# EAGLE design board (EAGLE 7.0.0)
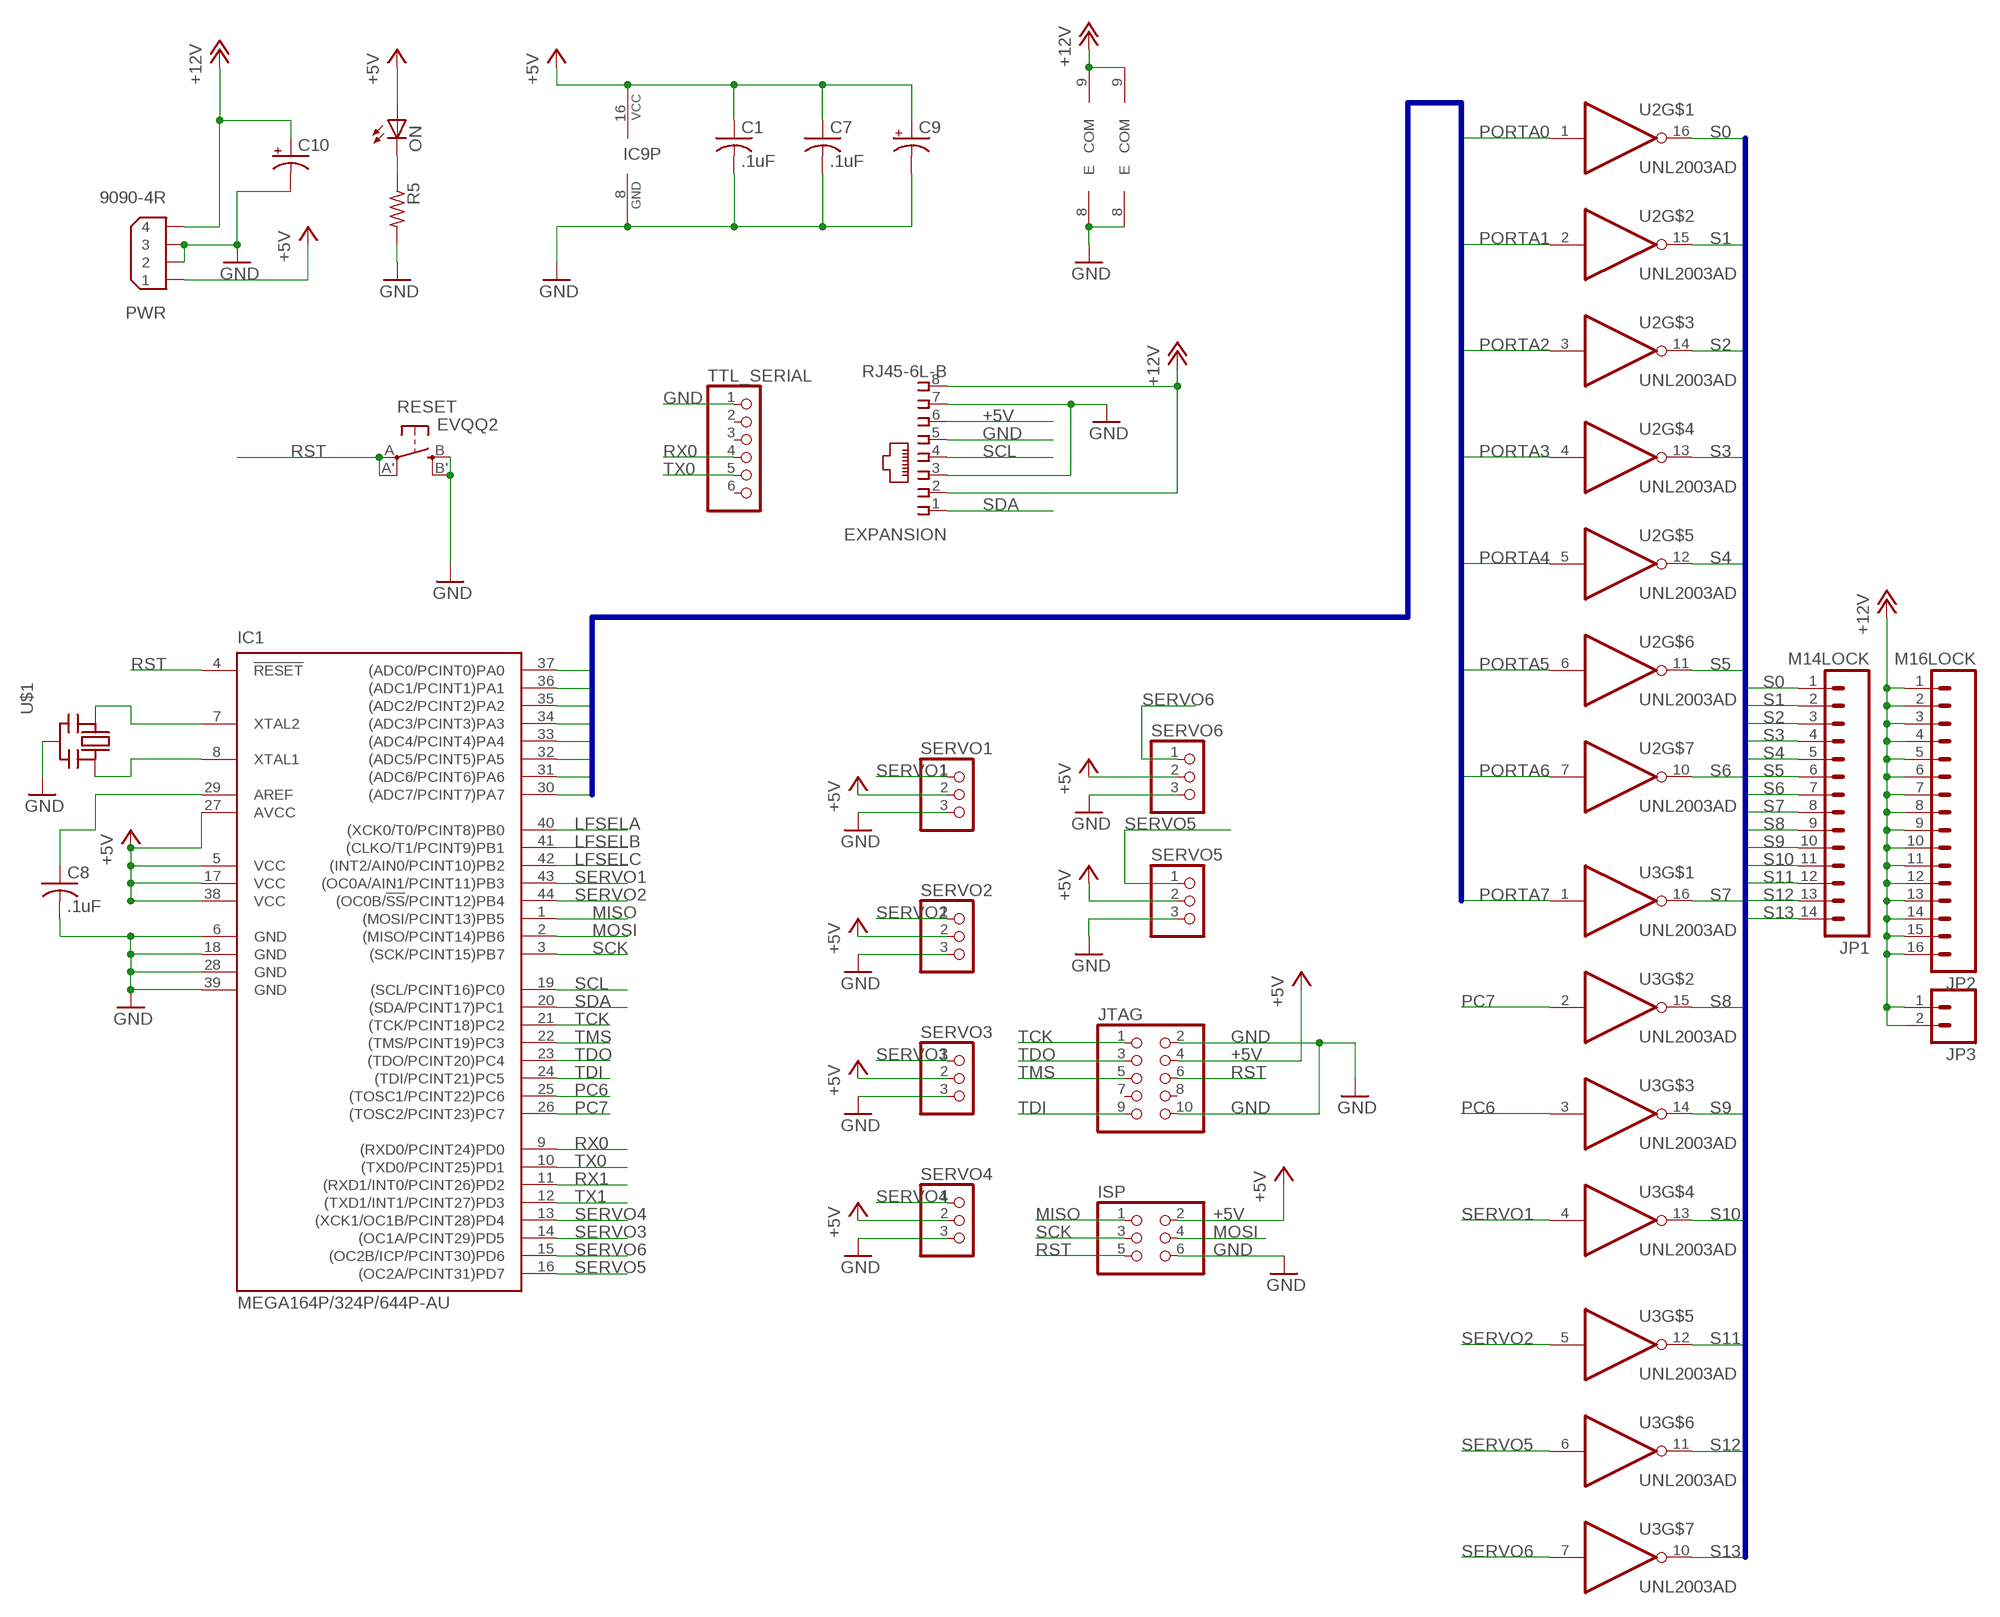
[diagram p0: schematic, sheet 1, part 1 of 2]
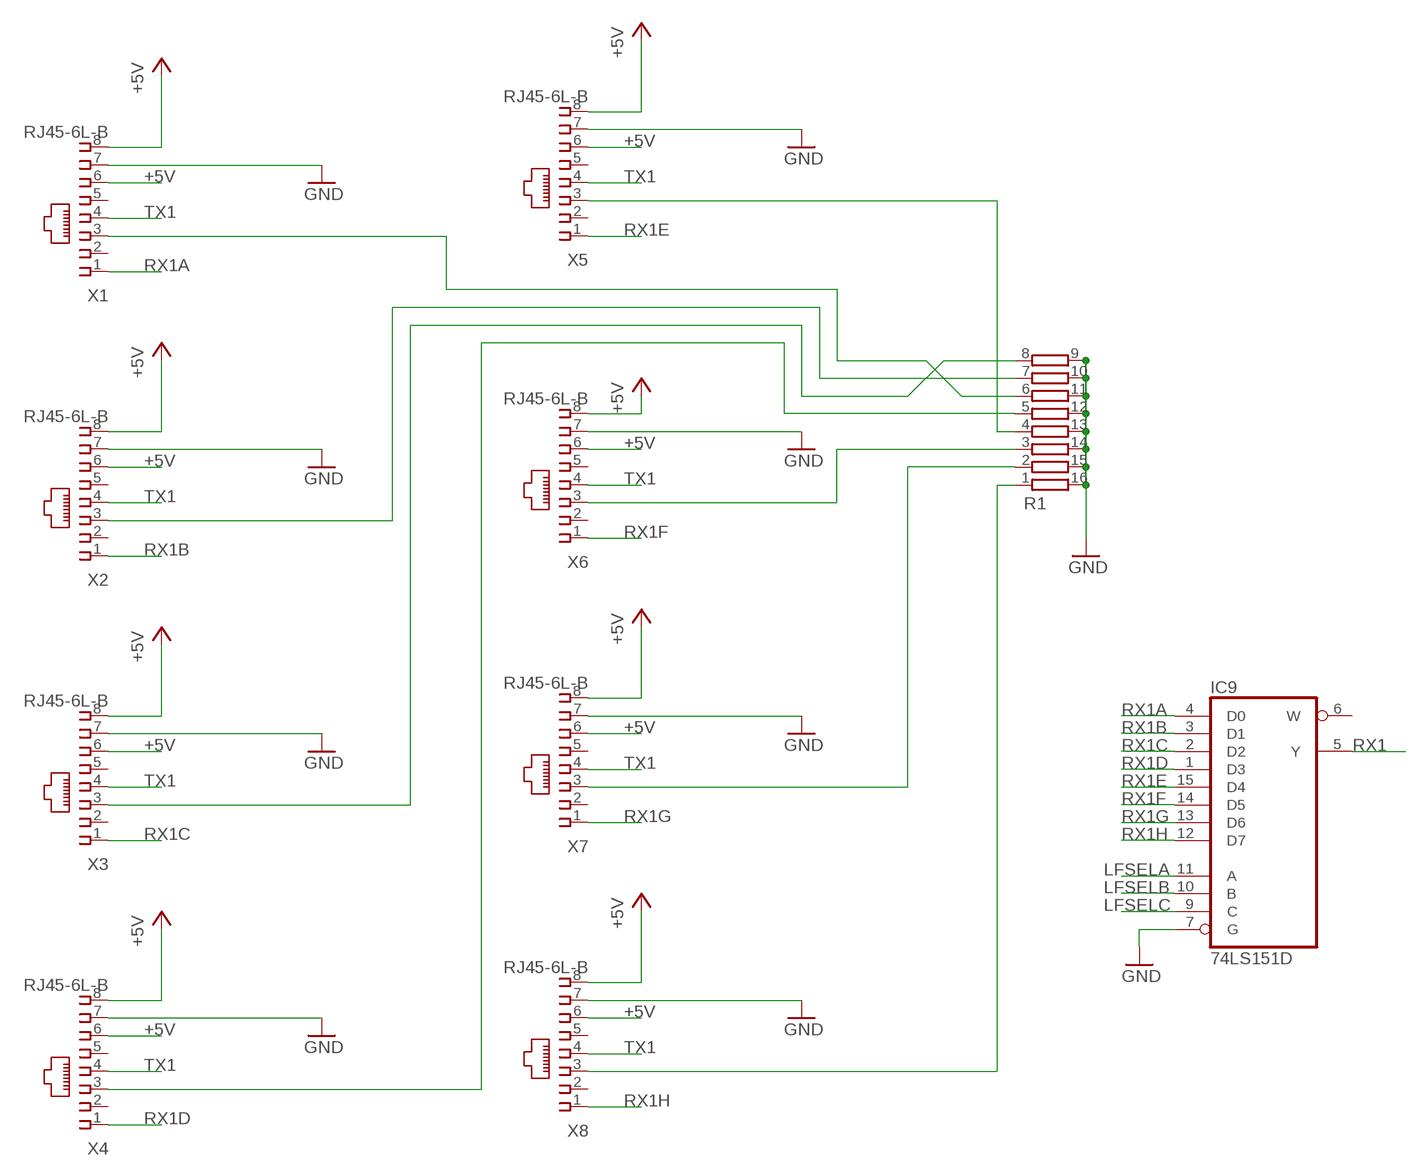
[diagram p1: schematic, sheet 1, part 2 of 2]

## Parts
C1  .1uF  C-USC0805  [C0805]
C7  .1uF  C-USC0805  [C0805]
C8  .1uF  C-USC0805  [C0805]
C9  CPOL-USE2.5-7  [E2,5-7]
C10  CPOL-USE2.5-7  [E2,5-7]
EXPANSION  RJ45-6L-B  [RJ45-NO-SHIELD]
IC1  MEGA164P/324P/644P-AU  [TQFP44]
IC9  74LS151D  [SO16]
ISP  PINHD-2X3  [2X03]
JP1  M14LOCK  [1X14_LOCK]
JP2  M16LOCK  [1X16_LOCK]
JP3  M02PTH  [1X02]
JTAG  PINHD-2X5  [2X05]
ON  LEDCHIPLED_0805  [CHIPLED_0805]
PWR  9090-4R  [9090-4R]
R1  2NBS16-8  [SO16]
R5  R-US_R0805  [R0805]
RESET  EVQQ2  [EVQ-Q2]
SERVO1  PINHD-1X3  [1X03]
SERVO2  PINHD-1X3  [1X03]
SERVO3  PINHD-1X3  [1X03]
SERVO4  PINHD-1X3  [1X03]
SERVO5  PINHD-1X3  [1X03]
SERVO6  PINHD-1X3  [1X03]
TTL_SERIAL  PINHD-1X6  [1X06]
U2  UNL2003AD  [SO16]
U3  UNL2003AD  [SO16]
U$1  CERMOSCILL-CSTCRG  [CSTCR-G]
X1  RJ45-6L-B  [RJ45-NO-SHIELD]
X2  RJ45-6L-B  [RJ45-NO-SHIELD]
X3  RJ45-6L-B  [RJ45-NO-SHIELD]
X4  RJ45-6L-B  [RJ45-NO-SHIELD]
X5  RJ45-6L-B  [RJ45-NO-SHIELD]
X6  RJ45-6L-B  [RJ45-NO-SHIELD]
X7  RJ45-6L-B  [RJ45-NO-SHIELD]
X8  RJ45-6L-B  [RJ45-NO-SHIELD]

## Nets
+5V [pwr12]: C1.1 C7.1 C9.+ EXPANSION.6 IC1.5(VCC) IC1.17(VCC) IC1.27(AVCC) IC1.38(VCC) IC9.16(VCC) ISP.2 JTAG.4 ON.A PWR.1 SERVO1.2 SERVO2.2 SERVO3.2 SERVO4.2 SERVO5.2 SERVO6.2 X1.6 X1.8 X2.6 X2.8 X3.6 X3.8 X4.6 X4.8 X5.6 X5.8 X6.6 X6.8 X7.6 X7.8 X8.6 X8.8
+12V [pwr12]: C10.+ EXPANSION.2 EXPANSION.8 JP2.1 JP2.2 JP2.3 JP2.4 JP2.5 JP2.6 JP2.7 JP2.8 JP2.9 JP2.10 JP2.11 JP2.12 JP2.13 JP2.14 JP2.15 JP2.16 JP3.1 JP3.2 PWR.4 U2.9(COM) U3.9(COM)
GND [pwr12]: C1.2 C7.2 C8.2 C9.- C10.- EXPANSION.3 EXPANSION.5 EXPANSION.7 IC1.6(GND) IC1.18(GND) IC1.28(GND) IC1.39(GND) IC9.7(G) IC9.8(GND) ISP.6 JTAG.2 JTAG.10 PWR.2 PWR.3 R1.9 R1.10 R1.11 R1.12 R1.13 R1.14 R1.15 R1.16 R5.2 RESET.B'(S1) RESET.B(S) SERVO1.3 SERVO2.3 SERVO3.3 SERVO4.3 SERVO5.3 SERVO6.3 TTL_SERIAL.1 U2.8(E) U3.8(E) U$1.2(GND) X1.7 X2.7 X3.7 X4.7 X5.7 X6.7 X7.7 X8.7
LFSELA: IC1.40((XCK0/T0/PCINT8)PB0) IC9.11(A)
LFSELB: IC1.41((CLKO/T1/PCINT9)PB1) IC9.10(B)
LFSELC: IC1.42((INT2/AIN0/PCINT10)PB2) IC9.9(C)
MISO: IC1.1((MOSI/PCINT13)PB5) ISP.1
MOSI: IC1.2((MISO/PCINT14)PB6) ISP.4
N$1: IC1.7(XTAL2) U$1.1(IN)
N$2: IC1.8(XTAL1) U$1.3(OUT)
N$3 [pwr12]: R1.1 X8.3
N$4 [pwr12]: R1.6 X1.3
N$5 [pwr12]: R1.7 X2.3
N$6 [pwr12]: R1.8 X3.3
N$7 [pwr12]: R1.5 X4.3
N$8 [pwr12]: R1.4 X5.3
N$9 [pwr12]: R1.3 X6.3
N$10 [pwr12]: R1.2 X7.3
N$17: C8.1 IC1.29(AREF)
N$31: ON.C R5.1
PC6: IC1.25((TOSC1/PCINT22)PC6) U3.3(I)
PC7: IC1.26((TOSC2/PCINT23)PC7) U3.2(I)
PORTA0: IC1.37((ADC0/PCINT0)PA0) U2.1(I)
PORTA1: IC1.36((ADC1/PCINT1)PA1) U2.2(I)
PORTA2: IC1.35((ADC2/PCINT2)PA2) U2.3(I)
PORTA3: IC1.34((ADC3/PCINT3)PA3) U2.4(I)
PORTA4: IC1.33((ADC4/PCINT4)PA4) U2.5(I)
PORTA5: IC1.32((ADC5/PCINT5)PA5) U2.6(I)
PORTA6: IC1.31((ADC6/PCINT6)PA6) U2.7(I)
PORTA7: IC1.30((ADC7/PCINT7)PA7) U3.1(I)
RST: IC1.4(!RESET) ISP.5 JTAG.6 RESET.A'(P1) RESET.A(P)
RX0: IC1.9((RXD0/PCINT24)PD0) TTL_SERIAL.4
RX1: IC1.11((RXD1/INT0/PCINT26)PD2) IC9.5(Y)
RX1A: IC9.4(D0) X1.1
RX1B: IC9.3(D1) X2.1
RX1C: IC9.2(D2) X3.1
RX1D: IC9.1(D3) X4.1
RX1E: IC9.15(D4) X5.1
RX1F: IC9.14(D5) X6.1
RX1G: IC9.13(D6) X7.1
RX1H: IC9.12(D7) X8.1
S0: JP1.1 U2.16(O)
S1: JP1.2 U2.15(O)
S2: JP1.3 U2.14(O)
S3: JP1.4 U2.13(O)
S4: JP1.5 U2.12(O)
S5: JP1.6 U2.11(O)
S6: JP1.7 U2.10(O)
S7: JP1.8 U3.16(O)
S8: JP1.9 U3.15(O)
S9: JP1.10 U3.14(O)
S10: JP1.11 U3.13(O)
S11: JP1.12 U3.12(O)
S12: JP1.13 U3.11(O)
S13: JP1.14 U3.10(O)
SCK: IC1.3((SCK/PCINT15)PB7) ISP.3
SCL: EXPANSION.4 IC1.19((SCL/PCINT16)PC0)
SDA: EXPANSION.1 IC1.20((SDA/PCINT17)PC1)
SERVO1: IC1.43((OC0A/AIN1/PCINT11)PB3) SERVO1.1 U3.4(I)
SERVO2: IC1.44((OC0B/!SS!/PCINT12)PB4) SERVO2.1 U3.5(I)
SERVO3: IC1.14((OC1A/PCINT29)PD5) SERVO3.1
SERVO4: IC1.13((XCK1/OC1B/PCINT28)PD4) SERVO4.1
SERVO5: IC1.16((OC2A/PCINT31)PD7) SERVO5.1 U3.6(I)
SERVO6: IC1.15((OC2B/ICP/PCINT30)PD6) SERVO6.1 U3.7(I)
TCK: IC1.21((TCK/PCINT18)PC2) JTAG.1
TDI: IC1.24((TDI/PCINT21)PC5) JTAG.9
TDO: IC1.23((TDO/PCINT20)PC4) JTAG.3
TMS: IC1.22((TMS/PCINT19)PC3) JTAG.5
TX0: IC1.10((TXD0/PCINT25)PD1) TTL_SERIAL.5
TX1: IC1.12((TXD1/INT1/PCINT27)PD3) X1.4 X2.4 X3.4 X4.4 X5.4 X6.4 X7.4 X8.4
Unconnected: IC9.6(W) JTAG.7 JTAG.8 TTL_SERIAL.2 TTL_SERIAL.3 TTL_SERIAL.6 X1.2 X1.5 X2.2 X2.5 X3.2 X3.5 X4.2 X4.5 X5.2 X5.5 X6.2 X6.5 X7.2 X7.5 X8.2 X8.5

## Buses
PORTA[0..7]
S[0..13]

## Library data of the parts
C1 C7 C8 = rcl:C-US: CAPACITOR, American symbol
C9 C10 = rcl:CPOL-US: POLARIZED CAPACITOR, American symbol
EXPANSION X1-X8 = con-tycoelectronics:RJ45: CORCOM Modular RJ Jacks No Shield Source: www.tycoelectronics.com .. ENG_DS_1654001_1099_RJ_L_0507.pdf; MPN: RJ45-6L-B; OC_FARNELL: unknown; OC_NEWARK: 16R6090
IC1 = avr-5:MEGA164P/324P/644P-AU
IC9 = 74xx-us:74*151: Data SELECTOR/MULTIPLEXER
ISP = pinhead:PINHD-2X3: PIN HEADER
JP1 = SparkFun-Connectors:M14: Header 14 Standard 14-pin 0.1" header. Use with straight break away headers (SKU : PRT-00116), right angle break away headers (PRT-00553), swiss pins (PRT-00743), machine pins (PRT-00117), and female headers (PRT-00115).
JP2 = SparkFun-Connectors:M16: 1x16 .1" header
JP3 = SparkFun-Connectors:M02: Header 2 Standard 2-pin 0.1" header. Use with straight break away headers (SKU : PRT-00116), right angle break away headers (PRT-00553), swiss pins (PRT-00743), machine pins (PRT-00117), and female headers (PRT-00115). Molex polarized connector foot print use with SKU : PRT-08233 with associated crimp pins and housings.
JTAG = pinhead:PINHD-2X5: PIN HEADER
ON = led:LED: LED OSRAM: - CHIPLED LG R971, LG N971, LY N971, LG Q971, LY Q971, LO R971, LY R971 LH N974, LH R974 LS Q976, LO Q976, LY Q976 LO Q996 - Hyper CHIPLED LW Q18S LB Q993, LB Q99A, LB R99A - SideLED LS A670, LO A670, LY A670, LG A670, LP A670 LB A673, LV A673, LT A673, LW A673 LH A674 LY A675 LS A676, LA A676, LO A676, LY A676, LW A676 LS A679, LY A679, LG A679 - Hyper Micro SIDELED® LS Y876, LA Y876, LO Y876, LY Y876 LT Y87S - SmartLED LW L88C, LW L88S LB L89C, LB L89S, LG L890 LS L89K, LO L89K, LY L89K LS L896, LA L896, LO L896, LY L896 - TOPLED LS T670, LO T670, LY T670, LG T670, LP T670 LSG T670, LSP T670, LSY T670, LOP T670, LYG T670 LG T671, LOG T671, LSG T671 LB T673, LV T673, LT T673, LW T673 LH T674 LS T676, LA T676, LO T676, LY T676, LB T676, LH T676, LSB T676, LW T676 LB T67C, LV T67C, LT T67C, LS T67K, LO T67K, LY T67K, LW E67C LS E67B, LA E67B, LO E67B, LY E67B, LB E67C, LV E67C, LT E67C LW T67C LS T679, LY T679, LG T679 LS T770, LO T770, LY T770, LG T770, LP T770 LB T773, LV T773, LT T773, LW T773 LH T774 LS E675, LA E675, LY E675, LS T675 LS T776, LA T776, LO T776, LY T776, LB T776 LHGB T686 LT T68C, LB T68C - Hyper Mini TOPLED® LB M676 - Mini TOPLED Santana® LG M470 LS M47K, LO M47K, LY M47K Source: http://www.osram.convergy.de LUXEON: - LUMILED® LXK2-PW12-R00, LXK2-PW12-S00, LXK2-PW14-U00, LXK2-PW14-V00 LXK2-PM12-R00, LXK2-PM12-S00, LXK2-PM14-U00 LXK2-PE12-Q00, LXK2-PE12-R00, LXK2-PE12-S00, LXK2-PE14-T00, LXK2-PE14-U00 LXK2-PB12-K00, LXK2-PB12-L00, LXK2-PB12-M00, LXK2-PB14-N00, LXK2-PB14-P00, LXK2-PB14-Q00 LXK2-PR12-L00, LXK2-PR12-M00, LXK2-PR14-Q00, LXK2-PR14-R00 LXK2-PD12-Q00, LXK2-PD12-R00, LXK2-PD12-S00 LXK2-PH12-R00, LXK2-PH12-S00 LXK2-PL12-P00, LXK2-PL12-Q00, LXK2-PL12-R00 Source: www.luxeon.com KINGBRIGHT: KA-3528ASYC Source: www.kingbright.com
PWR = con-thomas-betts:9090-4: Disk Drive Power four position Source: Thomas & Betts Electronic Interconnects Eiropean Edition 1998; OC_FARNELL: unknown; OC_NEWARK: unknown
R1 = resistor-bourns:2NBS16-8: BOURNS RESISTOR NETWORK; OC_FARNELL: unknown; OC_NEWARK: unknown
R5 = rcl:R-US_: RESISTOR, American symbol
RESET = adafruit:EVQQ2: SMT 6mm switch, EVQQ2 series http://www.ladyada.net/library/eagle
SERVO1-SERVO6 = pinhead:PINHD-1X3: PIN HEADER
TTL_SERIAL = pinhead:PINHD-1X6: PIN HEADER
U2 U3 = Chris_parts:UNL2003A
U$1 = adafruit:CERMOSCILL: Ceramic oscillator with built in capacitors such as ZTT-12MHz http://www.ladyada.net/library/eagle

## Net classes
0 default: width 0.254 mm, drill 0.3 mm, clearance 0.254 mm
1 pwr12: width 0.508 mm, drill 0.4 mm, clearance 0.254 mm

## Board
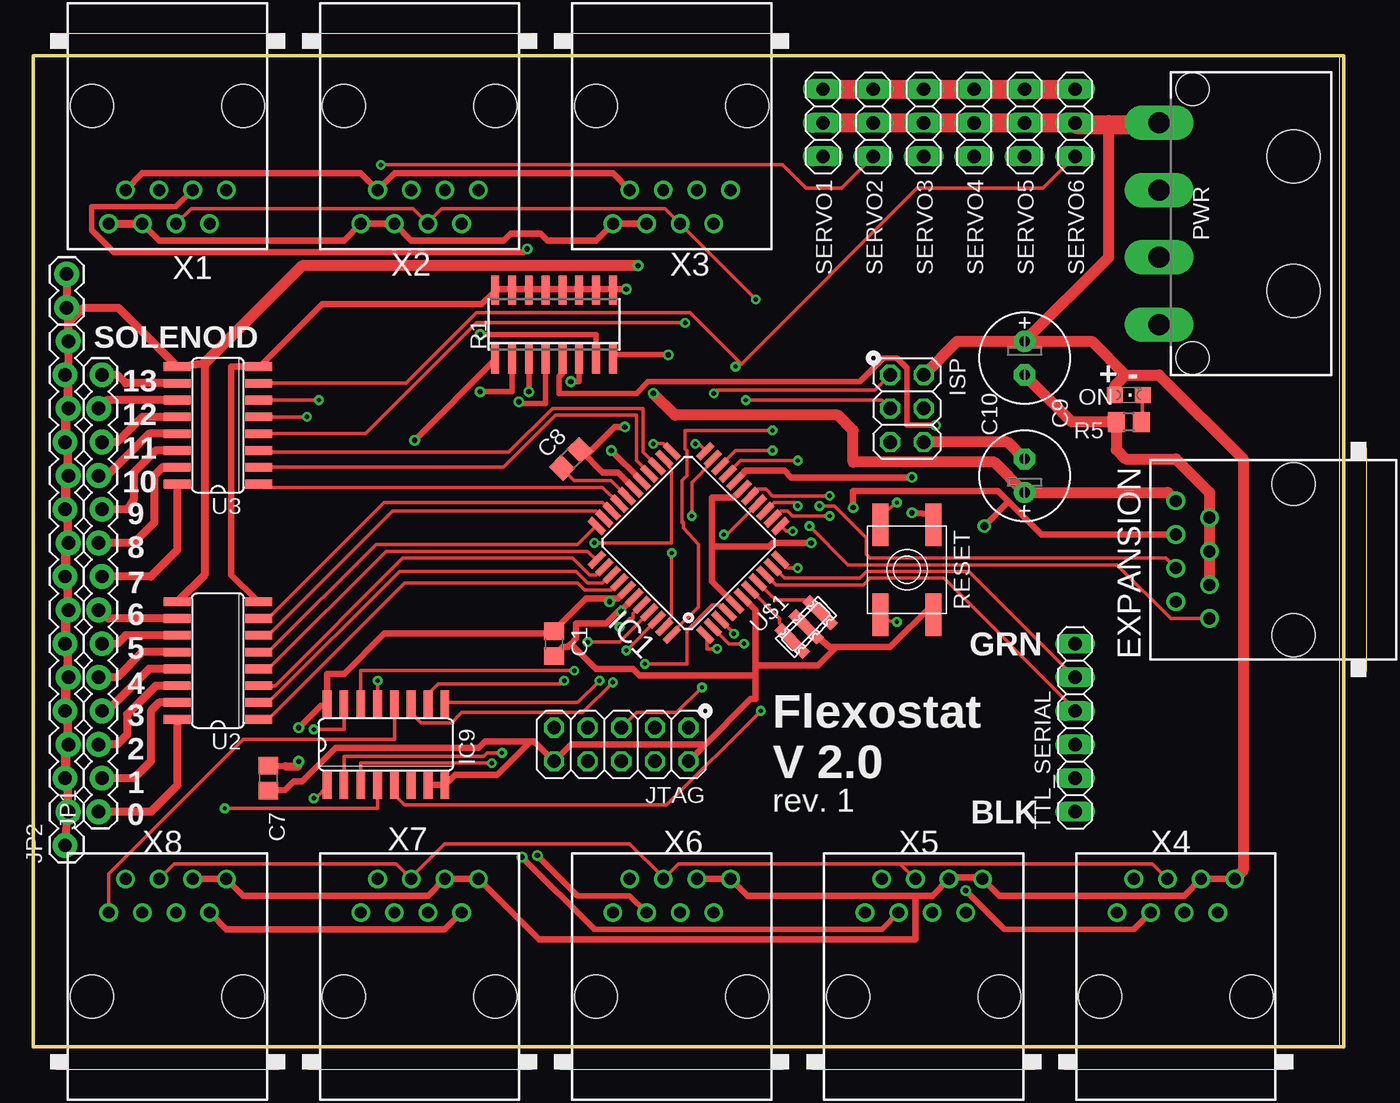
[diagram p2: board, top side]
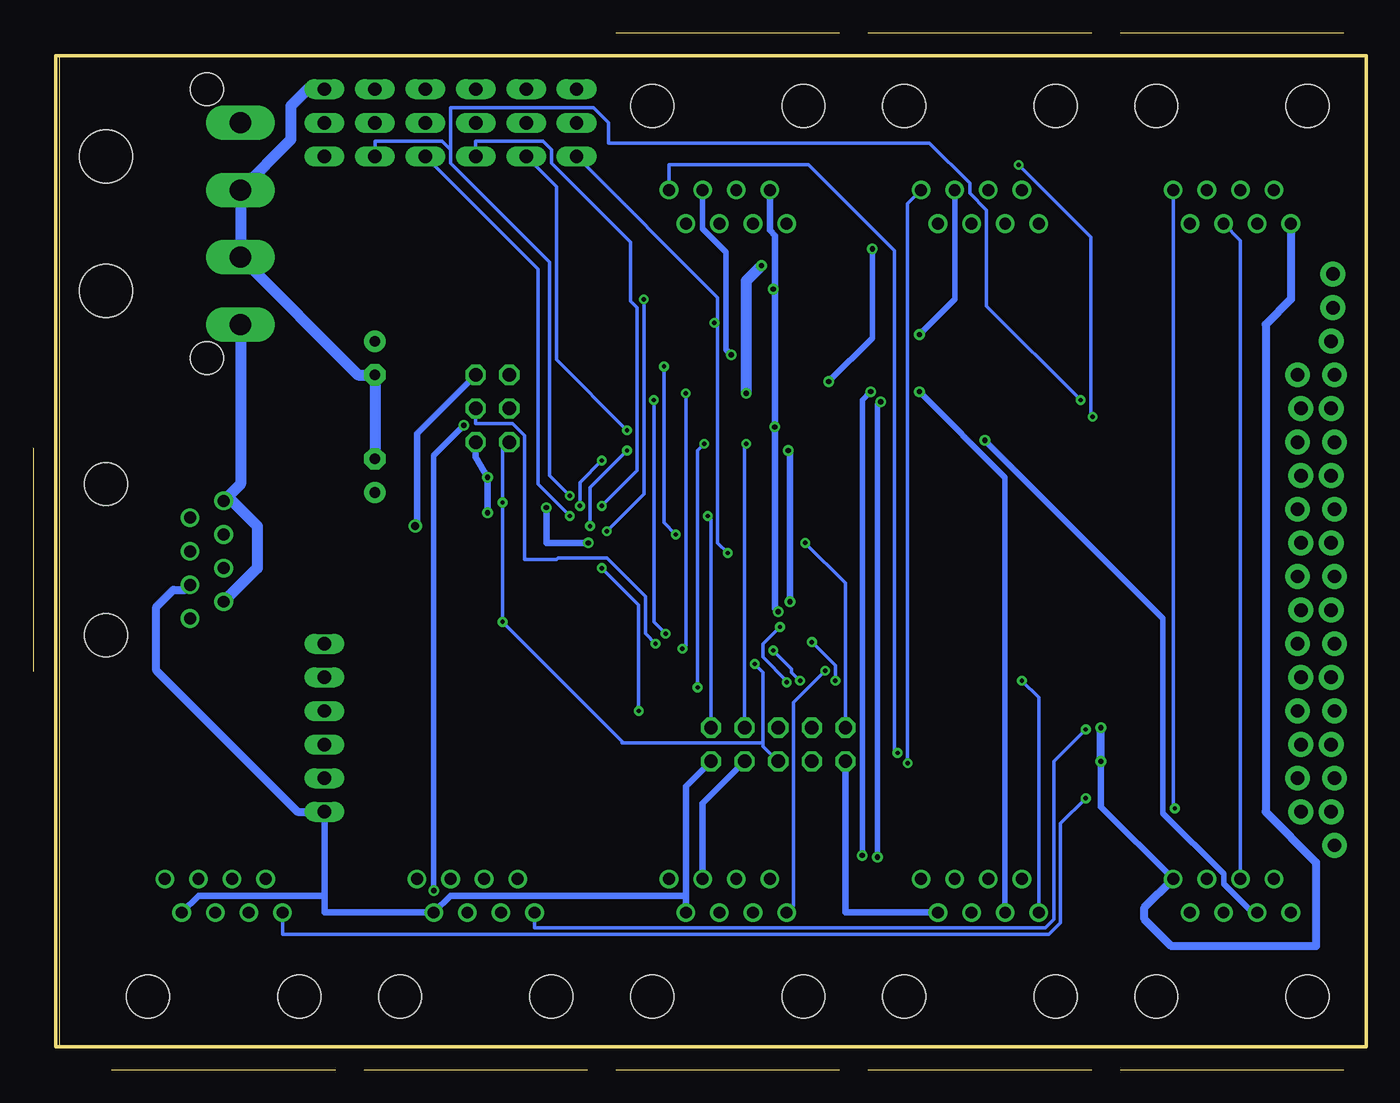
[diagram p3: board, bottom side, seen from below]

Size 98.73 x 74.92 mm. Coordinates in mm from the lower left corner, seen from the top.
Outline: 0,0 98.73,0 98.73,74.92 0,74.92 0,0
Copper layers (1*16): Top 0.035mm / dielectric 1.5mm / Bottom 0.035mm
Design rules "default *": minimum track width 10mil, minimum drill 13mil, track to track 8mil, track to pad 8mil, pad to pad 8mil, via to via 8mil, smd to smd 1mil, copper to edge 40mil, drill to drill 8mil, minimum pad ring 10mil, minimum via ring 8mil, stop-mask expansion 4mil, vias tented up to drill 0.61mm, thermal gap 10mil
vRestrict: area 42.9,36.1 to 51.3,44.5; area 43.2,31.8 to 50.3,39.9; area 47.5,31.8 to 55.9,40.1; area 49,36.1 to 55.9,44.5; area 21.6,20.8 to 31.8,24.6; area 34.3,53.6 to 44.5,56.1
Milling: 4 lines

### Footprints (pad centres in the part's own frame; a part is rotated, then mirrored left to right if it is on the bottom)
C0805 = smd 1.3 x 1.5: 1 -0.95,0; 2 0.95,0
E2,5-7 = drill 0.813 pad 1.6: + -1.27,0 | drill 0.813 pad 1.6 octagon: - 1.27,0
RJ45-NO-SHIELD = drill 0.9 pad 1.4: 1 -4.445,6.35; 2 -3.175,8.89; 3 -1.905,6.35; 4 -0.635,8.89; 5 0.635,6.35; 6 1.905,8.89; 7 3.175,6.35; 8 4.445,8.89 | hole 3.251: -5.715,0; 5.715,0
TQFP44 = smd 1.5 x 0.5: 1 -5.8,4; 2 -5.8,3.2; 3 -5.8,2.4; 4 -5.8,1.6; 5 -5.8,0.8; 6 -5.8,0; 7 -5.8,-0.8; 8 -5.8,-1.6; 9 -5.8,-2.4; 10 -5.8,-3.2; 11 -5.8,-4; 23 5.8,-4; 24 5.8,-3.2; 25 5.8,-2.4; 26 5.8,-1.6; 27 5.8,-0.8; 28 5.8,0; 29 5.8,0.8; 30 5.8,1.6; 31 5.8,2.4; 32 5.8,3.2; 33 5.8,4 | smd 0.5 x 1.5: 12 -4,-5.8; 13 -3.2,-5.8; 14 -2.4,-5.8; 15 -1.6,-5.8; 16 -0.8,-5.8; 17 0,-5.8; 18 0.8,-5.8; 19 1.6,-5.8; 20 2.4,-5.8; 21 3.2,-5.8; 22 4,-5.8; 34 4,5.8; 35 3.2,5.8; 36 2.4,5.8; 37 1.6,5.8; 38 0.8,5.8; 39 0,5.8; 40 -0.8,5.8; 41 -1.6,5.8; 42 -2.4,5.8; 43 -3.2,5.8; 44 -4,5.8
SO16 = smd 0.66 x 2.032: 1 -4.445,-3.073; 2 -3.175,-3.073; 3 -1.905,-3.073; 4 -0.635,-3.073; 5 0.635,-3.073; 6 1.905,-3.073; 7 3.175,-3.073; 8 4.445,-3.073; 9 4.445,3.073; 10 3.175,3.073; 11 1.905,3.073; 12 0.635,3.073; 13 -0.635,3.073; 14 -1.905,3.073; 15 -3.175,3.073; 16 -4.445,3.073
2X03 = drill 1.016 octagon: 1 -2.54,-1.27; 2 -2.54,1.27; 3 0,-1.27; 4 0,1.27; 5 2.54,-1.27; 6 2.54,1.27
1X14_LOCK = drill 1.016 pad 1.88: 1 0,0.127; 2 2.54,-0.127; 3 5.08,0.127; 4 7.62,-0.127; 5 10.16,0.127; 6 12.7,-0.127; 7 15.24,0.127; 8 17.78,-0.127; 9 20.32,0.127; 10 22.86,-0.127; 11 25.4,0.127; 12 27.94,-0.127; 13 30.48,0.127; 14 33.02,-0.127
1X16_LOCK = drill 1.016 pad 1.88: 1 0,0.127; 2 2.54,-0.127; 3 5.08,0.127; 4 7.62,-0.127; 5 10.16,0.127; 6 12.7,-0.127; 7 15.24,0.127; 8 17.78,-0.127; 9 20.32,0.127; 10 22.86,-0.127; 11 25.4,0.127; 12 27.94,-0.127; 13 30.48,0.127; 14 33.02,-0.127; 15 35.56,0.127; 16 38.1,-0.127
1X02 = drill 1.016 pad 1.88: 1 0,0; 2 2.54,0
2X05 = drill 1.016 octagon: 1 -5.08,-1.27; 2 -5.08,1.27; 3 -2.54,-1.27; 4 -2.54,1.27; 5 0,-1.27; 6 0,1.27; 7 2.54,-1.27; 8 2.54,1.27; 9 5.08,-1.27; 10 5.08,1.27
CHIPLED_0805 = smd 1.2 x 1.2: A 0,-1.05; C 0,1.05
9090-4R = drill 1.6 pad 2.6 long: 1 -7.62,-6.35; 2 -2.54,-6.35; 3 2.54,-6.35; 4 7.62,-6.35 | hole 4: -5.08,3.81; 5.08,3.81 | hole 2.5: -10.16,-3.81; 10.16,-3.81
SO16' = smd 0.6 x 2.2: 1 -4.445,-2.6; 2 -3.175,-2.6; 3 -1.905,-2.6; 4 -0.635,-2.6; 5 0.635,-2.6; 6 1.905,-2.6; 7 3.175,-2.6; 8 4.445,-2.6; 9 4.445,2.6; 10 3.175,2.6; 11 1.905,2.6; 12 0.635,2.6; 13 -0.635,2.6; 14 -1.905,2.6; 15 -3.175,2.6; 16 -4.445,2.6
R0805 = smd 1.3 x 1.5: 1 -0.95,0; 2 0.95,0
EVQ-Q2 = smd 3.2 x 1.2: A -3.4,-2; A' 3.4,-2; B -3.4,2; B' 3.4,2
1X03 = drill 1.016 long: 1 -2.54,0; 2 0,0; 3 2.54,0
1X06 = drill 1.016 long: 1 -6.35,0; 2 -3.81,0; 3 -1.27,0; 4 1.27,0; 5 3.81,0; 6 6.35,0
CSTCR-G = smd 0.8 x 3: 1 -1.5,0; 2 0,0; 3 1.5,0

### Placement (x,y rotation side)
C1  39.37,30.48 270 top
C7  17.78,20.32 270 top
C8  40.64,44.45 45 top
C9  74.93,52.07 270 top
C10  74.93,43.18 90 top
EXPANSION  95.25,36.83 90 top
IC1  49.53,38.1 135 top
IC9  26.67,22.86 0 top
ISP  66.04,48.26 270 top
JP1  5.08,17.78 90 top
JP2  2.54,15.24 90 top
JP3  2.54,55.88 90 top
JTAG  44.45,22.86 180 top
ON  82.8,49.28 270 top
PWR  91.44,62.23 270 top
R1  [SO16']  39.37,54.61 0 top
R5  82.8,47.24 180 top
RESET  66.04,36.07 270 top
SERVO1  59.69,69.85 90 top
SERVO2  63.5,69.85 90 top
SERVO3  67.31,69.85 90 top
SERVO4  71.12,69.85 90 top
SERVO5  74.93,69.85 90 top
SERVO6  78.74,69.85 90 top
TTL_SERIAL  78.74,24.13 90 top
U2  13.97,29.21 90 top
U3  13.97,46.99 90 top
U$1  58.42,31.75 45 top
X1  10.16,71.12 180 top
X2  29.21,71.12 180 top
X3  48.26,71.12 180 top
X4  86.36,3.81 0 top
X5  67.31,3.81 0 top
X6  48.26,3.81 0 top
X7  29.21,3.81 0 top
X8  10.16,3.81 0 top

### Tracks (layer width: path | path; a pad name or v marks a point on that pad's centre or on a via)
+5V  (via drill 0.4, 0.6 pad 0.3)
  Top 0.508: 81.66,49.28 ON.A | 74.8,53.21 C9.+ | 51.31,37.85 51.31,41.53 52.96,41.53 IC1.17 | 51.31,37.85 51.31,35.18 52.96,33.53 IC1.5 | 51.31,37.85 55.63,37.85 55.88,38.1 v58.8,38.1 | v61.98,40.77 61.98,42.04 72.9,42.04 73.72,41.21 | 73.72,41.21 76.2,38.73 EXPANSION.6 | X4.8 X4.6 87,11.43 73.03,11.43 X5.8 71.63,12.83 69.34,12.83 X5.6 67.94,11.43 66.67,11.43 | X6.6 X6.8 53.98,11.43 66.67,11.43 | 19.05,21.21 C7.1 | X8.6 X8.8 15.88,11.43 29.84,11.43 X7.6 X7.8 38.23,8.13 66.67,8.13 66.67,11.43 | 43.56,33.91 44.2,33.91 44.83,34.54 IC1.38 | 43.56,33.91 41.78,33.91 39.37,31.5 C1.1 39.24,31.24 26.54,31.24 23.5,28.19 22.23,28.19 IC9.16 22.1,25.78 21.72,25.78 v20.07,24.13 | v43.69,45.09 45.97,42.8 IC1.27 | X3.6 X3.8 42.55,60.96 38.86,60.96 38.35,61.47 36.07,61.47 35.56,60.96 28.57,60.96 X2.6 X2.8 23.5,60.96 9.53,60.96 X1.6 | v43.56,33.66 43.56,33.91 | v71.88,39.37 73.72,41.21 | SERVO6.2 78.87,69.72
  Top 0.61: 19.05,21.21 20.07,21.21 v20.07,21.59 | X1.8 X1.6
  Top 0.813: 72.39,69.85 SERVO4.2 | 84.96,69.72 PWR.1 | C9.+ 81.28,59.69 81.28,69.72 | ON.A 81.75,50 82.55,50.8 | 82.55,50.8 85.09,50.8 91.44,44.45 91.44,13.34 X4.8 | C9.+ 80.01,53.34 82.55,50.8 | ISP.2 69.85,53.34 C9.+
  Top 1.422: SERVO1.2 SERVO2.2 SERVO3.2 SERVO4.2 SERVO5.2 SERVO6.2 | 78.87,69.72 81.28,69.72 84.96,69.72
  Bottom 0.508: v58.8,38.1 61.98,38.1 v61.98,40.77 | JTAG.4 50.16,18.41 X6.6 | X3.8 43.69,62.1 | v43.56,33.66 43.56,44.96 v43.69,45.09 | X8.8 20.07,18.16 v20.07,21.59 | ISP.2 71.75,46.35 71.75,39.5 v71.88,39.37
  Bottom 0.61: v20.07,21.59 v20.07,24.13 | X1.8 5.71,56.52 7.62,54.61 7.62,17.78 3.81,13.97 3.81,7.62 14.73,7.62 16.76,9.65 16.76,10.54 X8.8
+12V  (via drill 0.4)
  Top 0.406: 2.79,20.32 JP2.1 | 10.92,33.66 U2.9 | JP2.16 2.54,53.34 JP3.1 | JP2.15 2.67,50.8 2.67,52.07
  Top 0.508: 11.05,33.78 U2.9
  Top 0.61: JP2.1 2.67,20.57 JP2.2 2.41,23.11 JP2.3 2.67,25.65 JP2.4 2.41,28.19 JP2.5 2.67,30.73 JP2.6 2.41,33.27 JP2.7 2.67,35.81 JP2.8 2.41,38.35 JP2.9 2.67,40.89 JP2.10 2.41,43.43 JP2.11 2.67,45.97 JP2.12 2.41,48.51 JP2.13 2.67,51.05 JP2.14 2.67,52.07 JP2.16 | JP2.16 2.67,54.74 3.81,55.88 6.45,55.88 U3.9 12.95,51.69 12.95,35.69 11.05,33.78 | JP3.2 JP3.1 2.67,55.88 JP2.16
  Top 0.813: 12.95,51.69 20.32,59.05 v45.72,59.05 | v46.86,49.4 48.51,47.75 60.83,47.75 61.98,46.61 61.98,44.2 72.64,44.2 C10.+ 85.72,41.91 EXPANSION.8
  Bottom 0.406: 86.23,41.4 EXPANSION.8
  Bottom 0.813: v45.72,59.05 46.86,57.91 v46.86,49.4 | PWR.4 85.09,42.55 EXPANSION.8 85.72,41.27 83.82,39.37 83.82,36.2 EXPANSION.2
GND  (via drill 0.4)
  Top 0.406: 53.59,43.31 53.09,42.8
  Top 0.508: 53.09,42.8 IC1.18 | v66.42,40.39 67.94,40.26 RESET.B | 81.79,47.24 R5.2 | 88.77,40.13 EXPANSION.7 | 17.02,33.66 U2.8 16.89,33.78 14.99,35.69 14.99,51.44 U3.8 17.27,51.56 21.84,56.13 33.91,56.13 34.8,57.02 R1.16 34.92,57.28 36.2,57.28 R1.15 36.32,57.28 37.47,57.28 R1.14 37.59,57.28 38.73,57.28 R1.13 38.86,57.28 40.01,57.28 R1.12 40.13,57.28 41.27,57.28 R1.11 41.4,57.28 42.55,57.28 R1.10 42.67,57.28 43.81,57.28 R1.9 43.94,57.28 v44.83,57.28 | IC1.28 45.34,42.29 44.2,43.43 43.05,43.43 41.4,45.09 C8.2 41.91,44.83 43.94,46.86 v44.7,46.86 | X1.7 8.26,66.04 24.77,66.04 X2.7 27.3,66.04 43.81,66.04 X3.7 | X8.7 14.61,8.89 31.11,8.89 X7.7 | IC9.7 29.84,19.81 31.11,19.81 IC9.8 31.24,19.94 31.88,20.57 35.05,20.57 37.47,22.99 37.47,23.11 | 37.47,23.11 37.85,23.11 JTAG.10 40.64,22.86 50.55,22.86 50.67,22.73 | 37.47,23.11 34.16,23.11 33.66,22.61 22.86,22.61 20.32,20.07 19.68,20.07 19.05,19.43 C7.2 | 40.64,30.48 41.02,30.86 41.02,32 43.31,32 44.32,33.02 | 40.64,30.48 40.39,30.23 40.01,30.23 39.37,29.59 C1.2 | 44.32,33.02 44.45,33.15 44.58,33.15 IC1.39 | 54.61,28.07 54.61,26.29 54.23,26.29 50.67,22.73 | 54.61,28.07 54.61,28.83 | 54.61,28.83 54.61,33.02 53.72,33.91 IC1.6 | JTAG.2 50.67,22.73 | 60.2,30.23 U$1.2 | 60.58,30.1 60.2,30.23 | 60.58,30.1 59.31,28.83 54.61,28.83 | 60.2,30.23 60.45,30.23 | 60.45,30.23 64.77,30.23 67.94,33.4 RESET.B' | 60.45,30.23 60.58,30.1 | 40.64,30.48 42.55,28.57 45.34,28.57 45.85,28.07 54.61,28.07 | v44.45,32.89 44.32,33.02 | 53.59,43.31 53.85,43.56 56.77,43.56 57.28,43.05 v66.42,43.05
  Top 0.813: C10.- 73.66,45.72 ISP.6 | C9.- 78.49,47.24 R5.2 81.85,45.15 82.55,44.45 86.36,44.45 88.9,41.91 EXPANSION.7 EXPANSION.5 EXPANSION.3
  Top 1.422: SERVO1.3 SERVO2.3 SERVO3.3 SERVO4.3 SERVO5.3 SERVO6.3
  Bottom 0.508: ISP.6 67.31,44.58 v66.42,43.05 66.42,42.93 v66.42,40.39 | 44.7,57.28 44.7,61.34 45.09,61.72 X3.7 | 44.7,57.28 v44.7,46.86 44.7,33.15 v44.45,32.89 | v44.83,57.28 44.7,57.28 | X7.7 39.37,10.16 JTAG.10 | TTL_SERIAL.1 78.74,11.43 | 78.74,11.43 78.74,10.16 X5.7 69.22,11.43 51.44,11.43 | X4.7 88.27,11.43 78.74,11.43 | 51.44,11.43 51.44,19.68 JTAG.2 | 51.44,11.43 X6.7 | 78.87,17.78 TTL_SERIAL.1 | 78.99,17.91 TTL_SERIAL.1
  Bottom 0.61: EXPANSION.3 89.28,34.54 90.17,34.54 91.44,33.27 91.44,28.45 80.77,17.78 TTL_SERIAL.1
  Bottom 0.813: SERVO6.3 80.01,72.39 81.28,71.12 81.28,68.58 PWR.2 PWR.3 76.2,50.8 C9.- C10.-
LFSELA  (via drill 0.33)
  Top 0.254: v44.32,31.75 44.45,31.75 45.09,32.38 45.34,32.38 45.34,32.77 45.97,33.4 IC1.40 | v43.81,27.56 41.53,25.27 32.38,25.27 31.62,24.51 29.34,24.51 28.57,25.27 IC9.11
  Bottom 0.254: v44.32,31.75 45.59,30.48 45.59,29.46 43.81,27.69 v43.81,27.56
LFSELB  (via drill 0.33)
  Top 0.254: v41.91,30.61 44.32,30.61 46.48,32.77 IC1.41 | v40.13,27.69 39.88,27.43 30.61,27.43 29.84,26.67 IC9.10
  Bottom 0.254: v41.91,30.61 40.13,28.83 v40.13,27.69
LFSELC  (via drill 0.33)
  Top 0.254: v44.83,29.97 47.12,32.26 IC1.42 | v42.8,27.69 41.15,26.04 31.11,26.04 IC9.9
  Bottom 0.254: v44.83,29.97 43.43,28.57 43.43,28.32 v42.8,27.69
MISO  (via drill 0.33)
  Top 0.254: v51.69,30.1 50.93,30.1 50.93,31.11 IC1.1 | v51.44,49.4 51.69,49.66 63.63,49.66 ISP.1
  Bottom 0.254: v51.69,30.1 51.44,30.35 v51.44,49.4
MOSI  (via drill 0.33)
  Top 0.254: v53.72,30.48 52.58,30.48 51.44,31.62 IC1.2
  Bottom 0.254: v53.72,30.48 54.48,31.24 54.48,34.04 57.4,36.96 61.09,36.96 61.21,36.83 63.63,36.83 63.63,46.23 64.52,47.12 67.31,47.12 ISP.4
N$1
  Top 0.254: U$1.1 57.36,31.03 56.39,32 56.39,32.37 IC1.7
N$2
  Top 0.254: 59.14,32.81 U$1.3 58.51,33.78 56.13,33.78 55.63,34.29 55.6,34.29 IC1.8
N$3  (via drill 0.4)
  Top 0.406: v28.83,45.85 34.92,51.94 R1.1
  Bottom 0.406: X8.3 8.64,10.16 10.79,12.32 10.79,13.08 15.37,17.65 15.37,32.38 v28.83,45.85
N$4  (via drill 0.4)
  Top 0.406: R1.6 41.27,50.29 v40.64,50.29 | 6.1,60.07 4.45,61.72 4.45,63.5 10.79,63.5 X1.3
  Top 0.508: 6.1,60.07 37.08,60.07 v37.34,60.33
  Bottom 0.406: v40.64,50.29 37.34,53.59 v37.34,60.33
N$5  (via drill 0.4)
  Top 0.406: R1.7 42.55,53.85 v33.78,53.85
  Bottom 0.406: v33.78,53.85 31.11,56.52 X2.3
N$6  (via drill 0.4)
  Top 0.406: v48.01,52.32 44.07,52.32 43.81,52.07 R1.8
  Bottom 0.406: v48.01,52.32 48.39,52.7 48.39,60.07 50.16,61.85 X3.3
N$7  (via drill 0.4)
  Top 0.406: R1.5 40.01,50.93 39.75,50.67 39.75,49.4 45.59,49.4 46.48,50.29 62.48,50.29 64.26,52.07 65.28,52.07 66.04,51.31 66.04,46.99 v68.2,46.99 | v70.48,11.81 73.41,8.89 83.19,8.89 X4.3
  Bottom 0.406: v68.2,46.99 70.48,44.7 v70.48,11.81
N$8  (via drill 0.4)
  Top 0.406: R1.4 38.73,48.64 36.83,48.64 v36.7,48.77 | v36.96,14.35 42.42,8.89 64.14,8.89 X5.3
  Bottom 0.406: v36.7,48.77 36.96,48.51 v36.96,14.35
N$9  (via drill 0.4)
  Top 0.406: v37.47,49.53 R1.3 | v38.1,14.48 41.15,11.43 45.09,11.43 X6.3
  Bottom 0.406: v37.47,49.53 38.1,48.9 v38.1,14.48
N$10  (via drill 0.4)
  Top 0.406: R1.2 36.2,49.53 v33.78,49.53
  Bottom 0.406: v33.78,49.53 27.3,43.05 X7.3
N$17
  Top 0.254: C8.1 40.01,43.69 40.89,42.8 43.69,42.8 44.83,41.66 IC1.29
N$31
  Top 0.254: ON.C 83.82,49.28 83.82,47.24 R5.1
PC6
  Top 0.254: IC1.25 47.12,43.94 46.1,44.96 46.1,48.26 39.24,48.26 35.94,44.96 17.27,44.96 17.14,45.09 U3.3
PC7
  Top 0.254: U3.2 35.56,43.81 39.5,47.75 45.59,47.75 45.59,44.32 46.48,43.43 IC1.26
PORTA0
  Top 0.254: U2.1 17.78,24.77 28.07,35.05 41.15,35.05 41.66,34.54 43.69,34.54 44.2,35.05 IC1.37
PORTA1
  Top 0.254: U2.2 17.78,26.04 27.69,35.94 41.02,35.94 41.91,35.05 43.05,35.05 43.69,35.69 IC1.36
PORTA2
  Top 0.254: U2.3 18.29,27.3 27.94,36.96 40.77,36.96 42.04,35.69 42.55,35.69 43.05,36.2 IC1.35
PORTA3
  Top 0.254: U2.4 17.78,28.57 26.67,37.47 41.91,37.47 42.55,36.83 IC1.34
PORTA4
  Top 0.254: U2.5 17.78,29.84 25.91,37.97 41.15,37.97 42.55,39.37 IC1.33
PORTA5
  Top 0.254: U2.6 17.78,31.11 27.18,40.51 42.55,40.51 43.05,40.01 IC1.32
PORTA6
  Top 0.254: U2.7 17.78,32.38 26.54,41.15 43.05,41.15 43.69,40.51 IC1.31
PORTA7
  Top 0.254: IC1.30 44.2,41.15 43.05,42.29 17.4,42.29 17.14,42.55 U3.1
RST  (via drill 0.33)
  Top 0.254: v65.28,41.15 64.14,40.26 RESET.A | v65.28,32.13 64.14,32.26 RESET.A' | v46.23,28.96 49.4,28.96 49.4,31.5 51.31,33.4 51.94,33.4 52.45,32.89 IC1.4
  Bottom 0.254: ISP.5 65.28,45.21 v65.28,41.15 v65.28,32.13 56.26,23.11 56.26,22.99 45.59,22.99 | v46.23,28.96 45.59,28.32 45.59,22.99 | 45.59,22.99 45.59,22.73 JTAG.6
RX0
  Top 0.254: TTL_SERIAL.4 78.74,25.53 68.83,35.43 63.25,35.43 62.74,34.92 56.13,34.92 55.37,35.69 IC1.9
RX1  (via drill 0.33)
  Top 0.254: v57.78,36.2 57.02,36.2 56.52,36.7 IC1.11 | v54.99,25.4 47.88,18.29 28.07,18.29 27.3,19.05 IC9.5
  Bottom 0.254: v57.78,36.2 54.99,33.4 v54.99,25.4
RX1A  (via drill 0.33)
  Top 0.254: IC9.4 26.04,18.03 v14.48,18.03
  Bottom 0.254: v14.48,18.03 14.61,18.16 X1.1
RX1B  (via drill 0.33)
  Top 0.254: IC9.3 24.77,21.46 v34.67,21.46
  Bottom 0.254: v34.67,21.46 34.67,63.75 X2.1
RX1C  (via drill 0.33)
  Top 0.254: IC9.2 23.5,21.97 34.04,21.97 34.29,22.23 v35.43,22.23
  Bottom 0.254: v35.43,22.23 35.69,22.48 35.69,60.2 42.16,66.67 52.7,66.67 X3.1
RX1D  (via drill 0.33)
  Top 0.254: v21.21,18.8 21.34,18.8 22.23,19.68 IC9.1
  Bottom 0.254: v21.21,18.8 23.11,16.89 23.11,9.4 24,8.51 81.92,8.51 X4.1
RX1E  (via drill 0.33)
  Top 0.254: IC9.15 23.5,24 v21.21,24
  Bottom 0.254: v21.21,24 23.62,21.59 23.62,9.65 24.26,9.02 62.87,9.02 X5.1
RX1F  (via drill 0.33)
  Top 0.254: IC9.14 24.77,28.45 v40.89,28.45
  Bottom 0.254: v40.89,28.45 43.31,26.04 43.31,10.67 X6.1
RX1G  (via drill 0.33)
  Top 0.254: v26.04,27.69 IC9.13
  Bottom 0.254: v26.04,27.69 24.77,26.42 X7.1
RX1H
  Top 0.254: IC9.12 27.3,23.24 15.88,23.24 5.71,13.08 X8.1
S0
  Top 0.61: U2.16 10.9,19.79 8.89,17.78 JP1.1
S1
  Top 0.61: U2.15 9.53,26.04 8.89,25.4 8.89,21.59 7.62,20.32 JP1.2
S2
  Top 0.61: U2.14 9.27,27.3 7.11,25.15 7.11,23.62 6.35,22.86 JP1.3
S3
  Top 0.61: U2.13 8.76,28.57 5.59,25.4 JP1.4
S4
  Top 0.61: U2.12 8.26,29.84 6.35,27.94 JP1.5
S5
  Top 0.61: U2.11 6.99,31.11 6.35,30.48 JP1.6
S6
  Top 0.61: U2.10 5.71,32.38 5.08,33.02 JP1.7
S7
  Top 0.61: U3.16 10.9,37.57 8.89,35.56 JP1.8
S8
  Top 0.61: U3.15 9.78,43.81 9.14,43.18 9.14,39.62 7.62,38.1 JP1.9
S9
  Top 0.61: U3.14 9.27,45.09 7.62,43.43 7.62,41.4 7.11,40.64 JP1.10
S10
  Top 0.61: U3.13 8.76,46.35 5.59,43.18 JP1.11
S11
  Top 0.61: U3.12 8.26,47.62 6.35,45.72 JP1.12
S12
  Top 0.61: U3.11 5.59,48.9 JP1.13
S13
  Top 0.61: U3.10 6.99,50.16 6.35,50.8 JP1.14
SCK  (via drill 0.33)
  Top 0.254: v52.96,31.24 51.94,32.26 IC1.3 | v53.85,48.9 64.14,48.9 ISP.3
  Bottom 0.254: v52.96,31.24 53.85,32.13 v53.85,48.9
SCL  (via drill 0.33)
  Top 0.254: v57.78,44.32 53.47,44.32 52.58,43.43 IC1.19 | v59.44,40.89 60.58,40.89 62.99,38.48 62.99,37.21 63.25,36.96 85.6,36.96 EXPANSION.4
  Bottom 0.254: v57.78,44.32 59.44,42.67 v59.44,40.89
SDA  (via drill 0.33)
  Top 0.254: v55.88,45.09 53.09,45.09 51.94,43.94 IC1.20 | v58.67,39.37 61.59,36.45 81.92,36.45 85.98,32.38 EXPANSION.1
  Bottom 0.254: v55.88,45.09 58.67,42.29 v58.67,39.37
SERVO1  (via drill 0.33)
  Top 0.254: v48.26,37.34 48.26,32.51 47.75,32 47.75,31.75 IC1.43 | U3.4 25.15,46.35 33.53,54.74 v49.28,54.74
  Bottom 0.254: v48.26,37.34 49.02,38.1 49.02,54.74 | 49.02,54.74 49.02,56.64 SERVO1.1 | 49.02,54.74 v49.28,54.74
SERVO2  (via drill 0.33)
  Top 0.254: v55.88,46.61 49.28,46.61 49.28,45.21 49.4,45.09 49.4,43.18 49.02,42.8 49.02,39.62 49.15,39.62 49.15,39.24 50.29,37.97 50.29,33.27 48.26,31.24 IC1.44 | v20.7,47.62 U3.5 | v26.29,66.67 56.64,66.67 58.42,64.9 61.09,64.9 SERVO2.1
  Bottom 0.254: v55.88,46.61 61.21,51.94 61.21,65.02 SERVO2.1 | v26.29,66.67 20.83,61.21 20.83,48.01 v20.7,47.62
SERVO3  (via drill 0.33)
  Top 0.254: v57.78,40.89 57.53,41.15 56.01,41.15 55.37,40.51 IC1.14
  Bottom 0.254: v57.78,40.89 55.12,43.56 55.12,55.88 55.63,56.39 55.63,60.83 61.59,66.8 61.59,67.82 62.23,68.45 67.31,68.45 SERVO3.1
SERVO4  (via drill 0.33)
  Top 0.254: v60.2,40.13 57.4,40.13 57.02,40.51 56.52,40.51 56.01,40.01 IC1.13
  Bottom 0.254: v60.2,40.13 62.61,42.55 62.61,58.8 SERVO4.1
SERVO5  (via drill 0.33)
  Top 0.254: v60.2,41.66 55.88,41.66 55.37,42.16 54.74,42.16 54.23,41.66 IC1.16 | v21.59,48.9 U3.6
  Bottom 0.254: v60.2,41.66 61.72,43.18 61.72,59.31 69.22,66.8 69.22,67.82 69.28,67.88 | 69.28,67.88 69.85,68.45 74.93,68.45 SERVO5.1 | 69.28,67.88 69.22,67.94 69.22,70.99 58.42,70.99 57.28,69.85 57.28,68.33 33.02,68.33 29.97,65.28 29.97,64.52 28.7,63.25 28.7,56.01 v21.59,48.9
SERVO6  (via drill 0.33)
  Top 0.254: 54.86,41.15 IC1.15 54.74,41.02 52.45,38.73 v52.2,38.73 | 53.53,51.63 66.8,64.9 76.33,64.9 SERVO6.1 | 53.53,51.63 v53.09,51.44 | U3.7 28.19,50.16 33.53,55.5 49.66,55.5 53.53,51.63
  Bottom 0.254: v53.09,51.44 53.09,39.62 v52.2,38.73
TCK  (via drill 0.33)
  Top 0.254: IC1.21 51.31,44.45 51.31,44.2 49.78,42.67 v49.78,40.13
  Bottom 0.254: v49.78,40.13 49.53,39.88 JTAG.1
TDI  (via drill 0.33)
  Top 0.254: v42.42,38.1 48.26,38.1 48.26,43.69 47.75,44.2 47.75,44.45 IC1.24
  Bottom 0.254: v42.42,38.1 39.37,35.05 JTAG.9
TDO  (via drill 0.33)
  Top 0.254: v46.86,45.59 47.62,45.59 48.13,45.09 IC1.23
  Bottom 0.254: v46.86,45.59 46.99,45.47 JTAG.3
TMS  (via drill 0.33)
  Top 0.254: v50.04,45.59 50.29,45.59 50.8,45.09 IC1.22 | v50.55,27.18 48.64,25.27 45.59,25.27 JTAG.5
  Bottom 0.254: v50.04,45.59 50.55,45.09 v50.55,27.18
TX0
  Top 0.254: TTL_SERIAL.5 70.74,35.94 62.99,35.94 62.48,35.43 56.77,35.43 56.01,36.2 IC1.10
TX1  (via drill 0.33)
  Top 0.254: X1.4 11.94,63.37 28.7,63.37 X2.4 29.84,62.36 30.86,63.37 47.75,63.37 X3.4 v54.61,56.52 | v57.4,38.99 56.9,38.99 56.52,39.37 IC1.12 | X8.4 10.67,13.84 27.43,13.84 X7.4 28.57,12.83 31.11,15.37 45.09,15.37 47.62,12.83 X6.4 48.77,13.84 65.53,13.84 65.6,13.78 | X5.4 65.6,13.78 | X4.4 84.58,13.84 65.66,13.84 65.6,13.78
  Bottom 0.254: v57.4,38.99 54.61,41.78 v54.61,56.52 | X1.4 9.53,60.96 X8.4

### Text on the board
tPlace: + -
tNames: SOLENOID | 13 | 12 | 11 | 10 | 9 | 8 | 7 | 6 | GRN | 5 | 4 | 3 | 2 | Flexostat / V 2.0 | 1 | rev. 1 | 0 | BLK